# Altium project BMS.PrjPcb (part 2 of 2)

## Sheet Cells.SchDoc
size A4
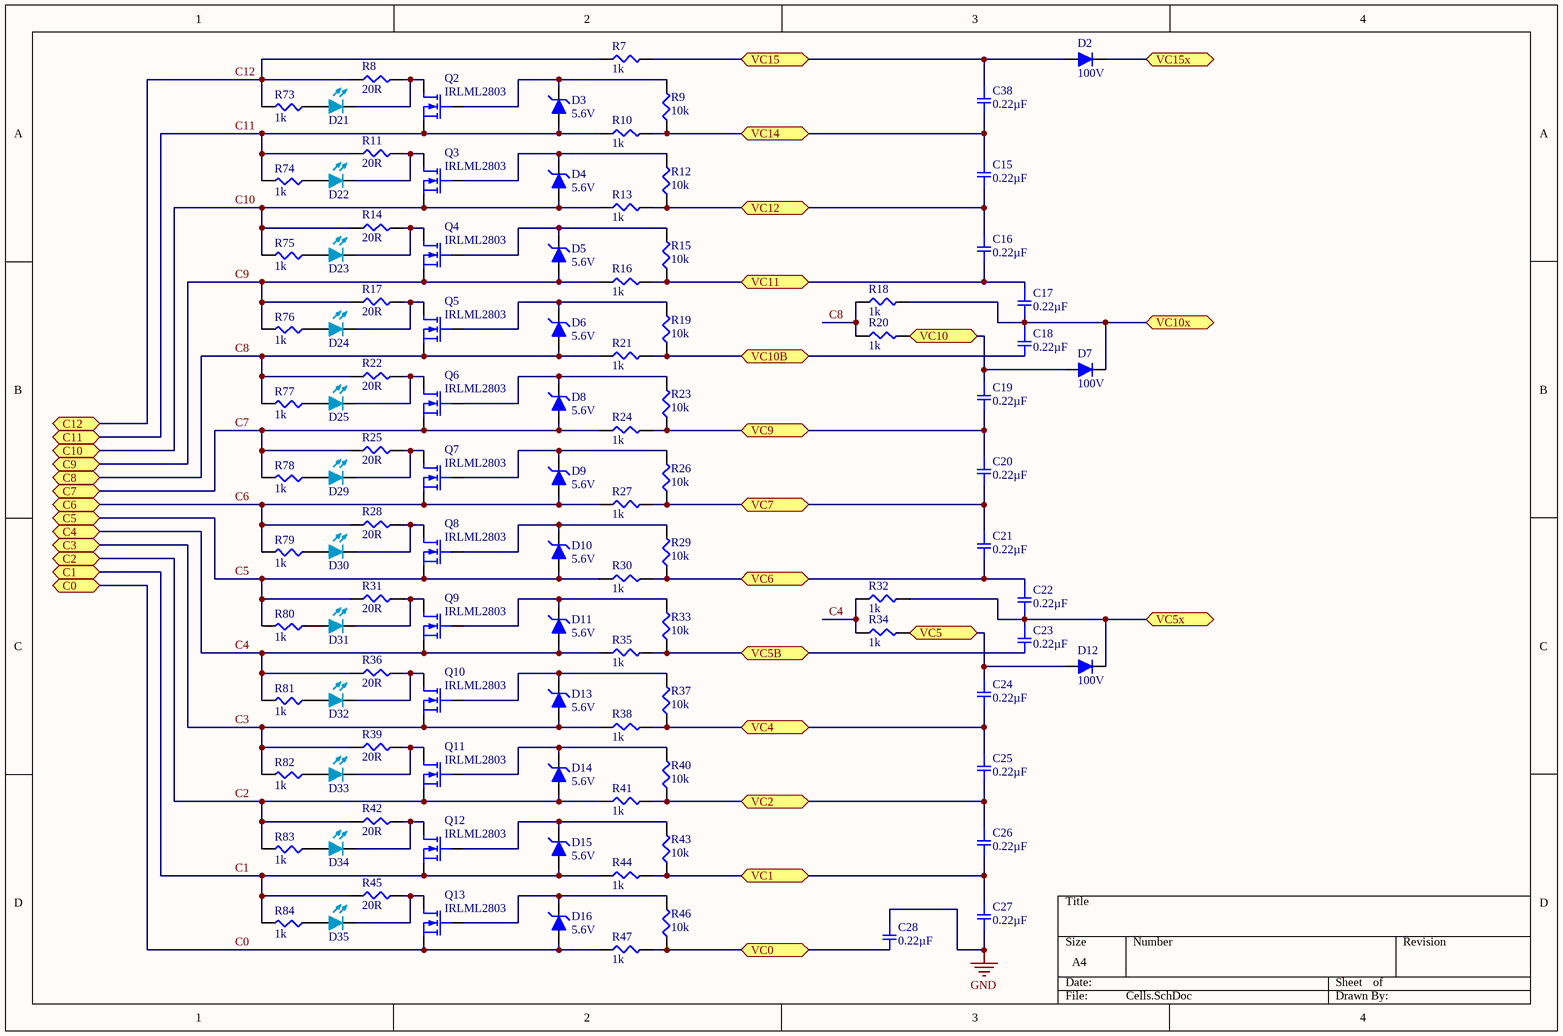
[diagram p6: Cells.SchDoc]

### Parts
C15  0.22µF  [SMD-0603C]
C16  0.22µF  [SMD-0603C]
C17  0.22µF  [SMD-0603C]
C18  0.22µF  [SMD-0603C]
C19  0.22µF  [SMD-0603C]
C20  0.22µF  [SMD-0603C]
C21  0.22µF  [SMD-0603C]
C22  0.22µF  [SMD-0603C]
C23  0.22µF  [SMD-0603C]
C24  0.22µF  [SMD-0603C]
C25  0.22µF  [SMD-0603C]
C26  0.22µF  [SMD-0603C]
C27  0.22µF  [SMD-0603C]
C28  0.22µF  [SMD-0603C]
C38  0.22µF  [SMD-0603C]
D2  100V  [SOD-323]
D3  5.6V  [SOD-323]
D4  5.6V  [SOD-323]
D5  5.6V  [SOD-323]
D6  5.6V  [SOD-323]
D7  100V  [SOD-323]
D8  5.6V  [SOD-323]
D9  5.6V  [SOD-323]
D10  5.6V  [SOD-323]
D11  5.6V  [SOD-323]
D12  100V  [SOD-323]
D13  5.6V  [SOD-323]
D14  5.6V  [SOD-323]
D15  5.6V  [SOD-323]
D16  5.6V  [SOD-323]
D21  LED  [LED0603]  (value not drawn)
D22  LED  [LED0603]  (value not drawn)
D23  LED  [LED0603]  (value not drawn)
D24  LED  [LED0603]  (value not drawn)
D25  LED  [LED0603]  (value not drawn)
D29  LED  [LED0603]  (value not drawn)
D30  LED  [LED0603]  (value not drawn)
D31  LED  [LED0603]  (value not drawn)
D32  LED  [LED0603]  (value not drawn)
D33  LED  [LED0603]  (value not drawn)
D34  LED  [LED0603]  (value not drawn)
D35  LED  [LED0603]  (value not drawn)
Q2  IRLML2803  [SOT23-3]
Q3  IRLML2803  [SOT23-3]
Q4  IRLML2803  [SOT23-3]
Q5  IRLML2803  [SOT23-3]
Q6  IRLML2803  [SOT23-3]
Q7  IRLML2803  [SOT23-3]
Q8  IRLML2803  [SOT23-3]
Q9  IRLML2803  [SOT23-3]
Q10  IRLML2803  [SOT23-3]
Q11  IRLML2803  [SOT23-3]
Q12  IRLML2803  [SOT23-3]
Q13  IRLML2803  [SOT23-3]
R7  1k  [SMD-0603-RES]
R8  20R  [SMD-1206-RES]
R9  10k  [SMD-0603-RES]
R10  1k  [SMD-0603-RES]
R11  20R  [SMD-1206-RES]
R12  10k  [SMD-0603-RES]
R13  1k  [SMD-0603-RES]
R14  20R  [SMD-1206-RES]
R15  10k  [SMD-0603-RES]
R16  1k  [SMD-0603-RES]
R17  20R  [SMD-1206-RES]
R18  1k  [SMD-0603-RES]
R19  10k  [SMD-0603-RES]
R20  1k  [SMD-0603-RES]
R21  1k  [SMD-0603-RES]
R22  20R  [SMD-1206-RES]
R23  10k  [SMD-0603-RES]
R24  1k  [SMD-0603-RES]
R25  20R  [SMD-1206-RES]
R26  10k  [SMD-0603-RES]
R27  1k  [SMD-0603-RES]
R28  20R  [SMD-1206-RES]
R29  10k  [SMD-0603-RES]
R30  1k  [SMD-0603-RES]
R31  20R  [SMD-1206-RES]
R32  1k  [SMD-0603-RES]
R33  10k  [SMD-0603-RES]
R34  1k  [SMD-0603-RES]
R35  1k  [SMD-0603-RES]
R36  20R  [SMD-1206-RES]
R37  10k  [SMD-0603-RES]
R38  1k  [SMD-0603-RES]
R39  20R  [SMD-1206-RES]
R40  10k  [SMD-0603-RES]
R41  1k  [SMD-0603-RES]
R42  20R  [SMD-1206-RES]
R43  10k  [SMD-0603-RES]
R44  1k  [SMD-0603-RES]
R45  20R  [SMD-1206-RES]
R46  10k  [SMD-0603-RES]
R47  1k  [SMD-0603-RES]
R73  1k  [SMD-0603-RES]
R74  1k  [SMD-0603-RES]
R75  1k  [SMD-0603-RES]
R76  1k  [SMD-0603-RES]
R77  1k  [SMD-0603-RES]
R78  1k  [SMD-0603-RES]
R79  1k  [SMD-0603-RES]
R80  1k  [SMD-0603-RES]
R81  1k  [SMD-0603-RES]
R82  1k  [SMD-0603-RES]
R83  1k  [SMD-0603-RES]
R84  1k  [SMD-0603-RES]

### Ports
C0, C1, C2, C3, C4, C5, C6, C7, C8, C9, C10, C11, C12, VC0, VC1, VC2, VC4, VC5, VC5B, VC5x, VC6, VC7, VC9, VC10, VC10B, VC10x, VC11, VC12, VC14, VC15, VC15x

### Nets
GND: C27.2 C28.1
C0: D16.2(A) Q13.2(S) R47.1 ; port C0
C1: D15.2(A) Q12.2(S) R44.1 R45.1 R84.2 ; port C1
C2: D14.2(A) Q11.2(S) R41.1 R42.1 R83.2 ; port C2
C3: D13.2(A) Q10.2(S) R38.1 R39.1 R82.2 ; port C3
C4: D11.2(A) Q9.2(S) R32.1 R34.1 R35.1 R36.1 R81.2 ; port C4
C5: D10.2(A) Q8.2(S) R30.1 R31.1 R80.2 ; port C5
C6: D9.2(A) Q7.2(S) R27.1 R28.1 R79.2 ; port C6
C7: D8.2(A) Q6.2(S) R24.1 R25.1 R78.2 ; port C7
C8: D6.2(A) Q5.2(S) R18.1 R20.1 R21.1 R22.1 R77.2 ; port C8
C9: D5.2(A) Q4.2(S) R16.1 R17.1 R76.2 ; port C9
C10: D4.2(A) Q3.2(S) R13.1 R14.1 R75.2 ; port C10
C11: D3.2(A) Q2.2(S) R10.1 R11.1 R74.2 ; port C11
C12: R7.1 R8.1 R73.2 ; port C12
VC0: C28.2 R46.1 R47.2 ; port VC0
VC1: C26.2 C27.1 R43.1 R44.2 ; port VC1
VC2: C25.2 C26.1 R40.1 R41.2 ; port VC2
VC4: C24.2 C25.1 R37.1 R38.2 ; port VC4
VC5: C24.1 D12.2(A) R34.2 ; port VC5
VC5B: C23.2 R33.1 R35.2 ; port VC5B
VC5x: C22.2 C23.1 D12.1(K) R32.2 ; port VC5x
VC6: C21.2 C22.1 R29.1 R30.2 ; port VC6
VC7: C20.2 C21.1 R26.1 R27.2 ; port VC7
VC9: C19.2 C20.1 R23.1 R24.2 ; port VC9
VC10: C19.1 D7.2(A) R20.2 ; port VC10
VC10B: C18.2 R19.1 R21.2 ; port VC10B
VC10x: C17.2 C18.1 D7.1(K) R18.2 ; port VC10x
VC11: C16.2 C17.1 R15.1 R16.2 ; port VC11
VC12: C15.2 C16.1 R12.1 R13.2 ; port VC12
VC14: C15.1 C38.2 R9.1 R10.2 ; port VC14
VC15: C38.1 D2.2(A) R7.2 ; port VC15
VC15x: D2.1(K) ; port VC15x
NetD3_1: D3.1(K) Q2.1(G) R9.2
NetD4_1: D4.1(K) Q3.1(G) R12.2
NetD5_1: D5.1(K) Q4.1(G) R15.2
NetD6_1: D6.1(K) Q5.1(G) R19.2
NetD8_1: D8.1(K) Q6.1(G) R23.2
NetD9_1: D9.1(K) Q7.1(G) R26.2
NetD10_1: D10.1(K) Q8.1(G) R29.2
NetD11_1: D11.1(K) Q9.1(G) R33.2
NetD13_1: D13.1(K) Q10.1(G) R37.2
NetD14_1: D14.1(K) Q11.1(G) R40.2
NetD15_1: D15.1(K) Q12.1(G) R43.2
NetD16_1: D16.1(K) Q13.1(G) R46.2
NetD21_A: D21.A R73.1
NetD21_C: D21.C Q2.3(D) R8.2
NetD22_A: D22.A R74.1
NetD22_C: D22.C Q3.3(D) R11.2
NetD23_A: D23.A R75.1
NetD23_C: D23.C Q4.3(D) R14.2
NetD24_A: D24.A R76.1
NetD24_C: D24.C Q5.3(D) R17.2
NetD25_A: D25.A R77.1
NetD25_C: D25.C Q6.3(D) R22.2
NetD29_A: D29.A R78.1
NetD29_C: D29.C Q7.3(D) R25.2
NetD30_A: D30.A R79.1
NetD30_C: D30.C Q8.3(D) R28.2
NetD31_A: D31.A R80.1
NetD31_C: D31.C Q9.3(D) R31.2
NetD32_A: D32.A R81.1
NetD32_C: D32.C Q10.3(D) R36.2
NetD33_A: D33.A R82.1
NetD33_C: D33.C Q11.3(D) R39.2
NetD34_A: D34.A R83.1
NetD34_C: D34.C Q12.3(D) R42.2
NetD35_A: D35.A R84.1
NetD35_C: D35.C Q13.3(D) R45.2

### Library data of the parts
C15-C28 C38 = GCJ188R71E224KA12D: CAP CER 0.22UF 25V X7R 0603; Manufacturer: Murata Electronics North America; Factory Stock: 0; Unit Price (USD): 0.24; Minimum Quantity: 1; Tolerance: ±10%; Datasheets: http://www.murata.com/~/media/webrenewal/support/library/catalog/products/capacitor/mlcc/c03e.ashx; Image: //media.digikey.com/Renders/Murata%20Renders/0603%28LQG18%29.jpg; Digi-Key Part Number: 490-5797-1-ND; Part Number: GCJ188R71E224KA12D; Quantity Available: 23903; @ qty: 0; Packaging: Cut Tape (CT); Series: GCJ; Part Status: Active; Value: 0.22µF; Voltage: 25V; Temperature Coefficient: X7R; Operating Temperature: -55°C ~ 125°C; Features: Soft Termination; Ratings: AEC-Q200; Applications: Automotive, Boardflex Sensitive; Mounting Type: Surface Mount, MLCC; Package / Case: 0603 (1608 Metric); Size / Dimension: 0.063" L x 0.031" W (1.60mm x 0.80mm); Height - Seated (Max): -; Thickness (Max): 0.035" (0.90mm); Lead Spacing: -; Lead Style: -
D2 D7 D12 = DIODE
D3-D6 D8-D11 D13-D16 = ZENER_5V6: Zener Diode 5.6V
D21-D25 D29-D35 = LED_BLUE: PartNumber: LTST-C193TGKT-5A; Manufacturer: Lite-On Inc.; PackageReference: 0603; PackageDescription: 0603 (1608 Metric); Mounting Technology: Surface Mount
Q2-Q13 = MOSFET-N: N-Channel MOSFET; Published: 8-Jun-2000; LatestRevisionDate: 17-Jul-2002; LatestRevisionNote: Re-released for DXP Platform.; PackageVersion: 1995/1996; PackageReference: E3; Publisher: Altium Limited; PackageDescription: TO, Flat Index; 3 In-Line, Axial Leads; Body Dia. 4.6mm; Lead Dia. 0.5 mm (max)
R7 R10 R13 R16 R18 R20 R21 R24 R27 R30 R32 R34 R35 R38 R41 R44 R47 R73-R84 = ERJ-3EKF1001V: RES SMD 1K OHM 1% 1/10W 0603; Manufacturer: Panasonic Electronic Components; Factory Stock: 0; Unit Price (USD): 0.00379; @ qty: 1500; Minimum Quantity: 1; Power (Watts): 0.1W, 1/10W; Temperature Coefficient: ±100ppm/°C; Part Number: ERJ-3EKF1001V; Datasheets: http://industrial.panasonic.com/www-cgi/jvcr13pz.cgi?E+PZ+3+AOA0002+ERJ3EKF1001V+7+WW; Image: //media.digikey.com/Photos/Panasonic%20Photos/MFG_ERJ-P6W%20Series.jpg; Digi-Key Part Number: P1.00KHCT-ND; Quantity Available: 5218845; Packaging: Cut Tape (CT); Series: ERJ; Part Status: Active; Value: 1k; Tolerance: ±1%; Composition: Thick Film; Features: Automotive AEC-Q200; Operating Temperature: -55°C ~ 155°C; Package / Case: 0603 (1608 Metric); Supplier Device Package: 0603; Size / Dimension: 0.063" L x 0.031" W (1.60mm x 0.80mm); Height - Seated (Max): 0.022" (0.55mm); Number of Terminations: 2; Failure Rate: -
R8 R11 R14 R17 R22 R25 R28 R31 R36 R39 R42 R45 = ERJ-8ENF20R0V: RES SMD 20 OHM 1% 1/4W 1206; Manufacturer: Panasonic Electronic Components; Factory Stock: 0; Unit Price (USD): 0.00933; @ qty: 1500; Minimum Quantity: 1; Value: 20; Power (Watts): 0.25W, 1/4W; Temperature Coefficient: ±100ppm/°C; Part Number: ERJ-8ENF20R0V; Datasheets: http://industrial.panasonic.com/www-cgi/jvcr13pz.cgi?E+PZ+3+AOA0002+ERJ8ENF20R0V+7+WW; Image: //media.digikey.com/Renders/Panasonic%20Renders/ERJ-1206%20Pkg.jpg; Digi-Key Part Number: P20.0FCT-ND; Quantity Available: 622513; Packaging: Cut Tape (CT); Series: ERJ; Part Status: Active; Tolerance: ±1%; Composition: Thick Film; Features: Automotive AEC-Q200; Operating Temperature: -55°C ~ 155°C; Package / Case: 1206 (3216 Metric); Supplier Device Package: 1206; Size / Dimension: 0.126" L x 0.063" W (3.20mm x 1.60mm); Height - Seated (Max): 0.028" (0.70mm); Number of Terminations: 2; Failure Rate: -
R9 R12 R15 R19 R23 R26 R29 R33 R37 R40 R43 R46 = ERJ-3EKF1002V: RES SMD 10K OHM 1% 1/10W 0603; Manufacturer: Panasonic Electronic Components; Factory Stock: 0; Unit Price (USD): 0.00379; @ qty: 1500; Minimum Quantity: 1; Power (Watts): 0.1W, 1/10W; Temperature Coefficient: ±100ppm/°C; Part Number: ERJ-3EKF1002V; Datasheets: http://industrial.panasonic.com/www-cgi/jvcr13pz.cgi?E+PZ+3+AOA0002+ERJ3EKF1002V+7+WW; Image: //media.digikey.com/Photos/Panasonic%20Photos/MFG_ERJ-P6W%20Series.jpg; Digi-Key Part Number: P10.0KHCT-ND; Quantity Available: 6703141; Packaging: Cut Tape (CT); Series: ERJ; Part Status: Active; Value: 10k; Tolerance: ±1%; Composition: Thick Film; Features: Automotive AEC-Q200; Operating Temperature: -55°C ~ 155°C; Package / Case: 0603 (1608 Metric); Supplier Device Package: 0603; Size / Dimension: 0.063" L x 0.031" W (1.60mm x 0.80mm); Height - Seated (Max): 0.022" (0.55mm); Number of Terminations: 2; Failure Rate: -

## Sheet ChargerDetection.SchDoc
size A4
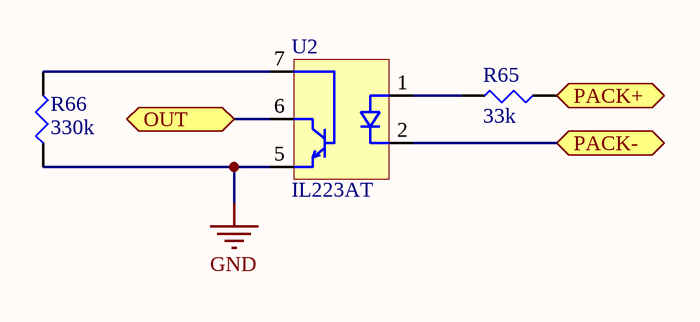
[diagram p7: ChargerDetection.SchDoc]

### Parts
R65  33k  [SMD-0603-RES]
R66  330k  [SMD-0603-RES]
U2  IL223AT  [SOIC-8]

### Ports
OUT, PACK+, PACK-

### Nets
GND: R66.1 U2.5(E)
PACK+: R65.1 ; port PACK+
PACK-: U2.2(K) ; port PACK-
CHG_DETECT: U2.6(C) ; port OUT
NetR65_2: R65.2 U2.1(A)
NetR66_2: R66.2 U2.7(B)

### Library data of the parts
R65 = ERJ-3EKF3302V: RES SMD 33K OHM 1% 1/10W 0603; Manufacturer: Panasonic Electronic Components; Factory Stock: 0; Unit Price (USD): 0.00379; @ qty: 1500; Minimum Quantity: 1; Power (Watts): 0.1W, 1/10W; Temperature Coefficient: ±100ppm/°C; Part Number: ERJ-3EKF3302V; Datasheets: http://industrial.panasonic.com/www-cgi/jvcr13pz.cgi?E+PZ+3+AOA0002+ERJ3EKF3302V+7+WW; Image: //media.digikey.com/Photos/Panasonic%20Photos/MFG_ERJ-P6W%20Series.jpg; Digi-Key Part Number: P33.0KHCT-ND; Quantity Available: 240194; Packaging: Cut Tape (CT); Series: ERJ; Part Status: Active; Value: 33k; Tolerance: ±1%; Composition: Thick Film; Features: Automotive AEC-Q200; Operating Temperature: -55°C ~ 155°C; Package / Case: 0603 (1608 Metric); Supplier Device Package: 0603; Size / Dimension: 0.063" L x 0.031" W (1.60mm x 0.80mm); Height - Seated (Max): 0.022" (0.55mm); Number of Terminations: 2; Failure Rate: -
R66 = ERJ-3EKF3303V: RES SMD 330K OHM 1% 1/10W 0603; Manufacturer: Panasonic Electronic Components; Factory Stock: 0; Unit Price (USD): 0.00379; @ qty: 1500; Minimum Quantity: 1; Power (Watts): 0.1W, 1/10W; Temperature Coefficient: ±100ppm/°C; Part Number: ERJ-3EKF3303V; Datasheets: http://industrial.panasonic.com/www-cgi/jvcr13pz.cgi?E+PZ+3+AOA0002+ERJ3EKF3303V+7+WW; Image: //media.digikey.com/Photos/Panasonic%20Photos/MFG_ERJ-P6W%20Series.jpg; Digi-Key Part Number: P330KHCT-ND; Quantity Available: 124170; Packaging: Cut Tape (CT); Series: ERJ; Part Status: Active; Value: 330k; Tolerance: ±1%; Composition: Thick Film; Features: Automotive AEC-Q200; Operating Temperature: -55°C ~ 155°C; Package / Case: 0603 (1608 Metric); Supplier Device Package: 0603; Size / Dimension: 0.063" L x 0.031" W (1.60mm x 0.80mm); Height - Seated (Max): 0.022" (0.55mm); Number of Terminations: 2; Failure Rate: -
U2 = IL223AT: Optocoupler

## Nets that join several sheets
3V3: BMS (11 pins), BQ76940 (C12.1 U1.8), U_Isolator (Q17_U_Isolator#1.2), U_Isolator (Q17_U_Isolator#2.2), U_Isolator (Q17_U_Isolator#3.2), EEPROM (C40.1 U4.8), NRF52 (C10.1 M1.11 R63.2 R64.2)
GND: BMS (5 pins), BQ76940 (10 pins), ProtectionAndShunt (C31.1 C33.2 NT1.1 Q14.1), U_Isolator (C42_U_Isolator#1.2 U3_U_Isolator#1.4), U_Isolator (C42_U_Isolator#2.2 U3_U_Isolator#2.4), U_Isolator (C42_U_Isolator#3.2 U3_U_Isolator#3.4), EEPROM (5 pins), NRF52 (8 pins), Cells (C27.2 C28.1), ChargerDetection (R66.1 U2.5)
PACK+: BMS (6 pins), ProtectionAndShunt (C29.2 D17.1 D18.1), ChargerDetection (R65.1)
PACK-: BMS (5 pins), ProtectionAndShunt (15 pins), ChargerDetection (U2.2)
ALERT: BQ76940 (C14.1 R5.2 U1.44), NRF52 (M1.21)
BAT-: BMS (BAT-.1), ProtectionAndShunt (D18.2 NT1.2 NT2.1 R52.1)
BTN_BOOT: BMS (BOOT.2), BQ76940 (R6.1)
BTN_PAIR: BMS (PAIR.1), NRF52 (M1.35)
BTN_STAT: BMS (STAT.1), NRF52 (M1.34)
C0: BMS (CELLS.1), Cells (D16.2 Q13.2 R47.1)
C1: BMS (BOOT.1 CELLS.2), Cells (5 pins)
C2: BMS (CELLS.3), Cells (5 pins)
C3: BMS (CELLS.4), Cells (5 pins)
C4: BMS (CELLS.5), Cells (7 pins)
C5: BMS (CELLS.6), Cells (5 pins)
C6: BMS (CELLS.7), Cells (5 pins)
C7: BMS (CELLS.8), Cells (5 pins)
C8: BMS (CELLS.9), Cells (7 pins)
C9: BMS (CELLS.10), Cells (5 pins)
C10: BMS (CELLS.11), Cells (5 pins)
C11: BMS (CELLS.12), Cells (5 pins)
C12: BMS (CELLS.13), BQ76940 (C1.1 D1.2 R1.2 R2.2), Cells (R7.1 R8.1 R73.2)
CHG: BQ76940 (U1.2), ProtectionAndShunt (Q14.2)
CHG_DETECT: NRF52 (M1.8), ChargerDetection (U2.6)
DSG: BQ76940 (U1.1), ProtectionAndShunt (L1.2 L7.2 R50.2)
EXT1.EN: U_Isolator (R67_U_Isolator#1.2), NRF52 (M1.7)
EXT1.IN: U_Isolator (U3_U_Isolator#1.2), NRF52 (M1.6)
EXT1.OUT: U_Isolator (U3_U_Isolator#1.3), NRF52 (M1.5)
EXT2.EN: U_Isolator (R67_U_Isolator#2.2), NRF52 (M1.4)
EXT2.IN: U_Isolator (U3_U_Isolator#2.2), NRF52 (M1.3)
EXT2.OUT: U_Isolator (U3_U_Isolator#2.3), NRF52 (M1.2)
EXT3.EN: U_Isolator (R67_U_Isolator#3.2), NRF52 (M1.15)
EXT3.IN: U_Isolator (U3_U_Isolator#3.2), NRF52 (M1.16)
EXT3.OUT: U_Isolator (U3_U_Isolator#3.3), NRF52 (M1.17)
EXT_GND: BMS (EXT1.2), U_Isolator (5 pins)
EXT_GND: BMS (EXT2.2), U_Isolator (5 pins)
EXT_GND: BMS (EXT3.2), U_Isolator (5 pins)
EXT_IN: BMS (EXT1.5), U_Isolator (D26_U_Isolator#1.1 U3_U_Isolator#1.7)
EXT_IN: BMS (EXT2.5), U_Isolator (D26_U_Isolator#2.1 U3_U_Isolator#2.7)
EXT_IN: BMS (EXT3.5), U_Isolator (D26_U_Isolator#3.1 U3_U_Isolator#3.7)
EXT_OUT: BMS (EXT1.4), U_Isolator (D27_U_Isolator#1.1 U3_U_Isolator#1.6)
EXT_OUT: BMS (EXT2.4), U_Isolator (D27_U_Isolator#2.1 U3_U_Isolator#2.6)
EXT_OUT: BMS (EXT3.4), U_Isolator (D27_U_Isolator#3.1 U3_U_Isolator#3.6)
EXT_VCC: BMS (EXT1.3), U_Isolator (L5_U_Isolator#1.1)
EXT_VCC: BMS (EXT2.3), U_Isolator (L5_U_Isolator#2.1)
EXT_VCC: BMS (EXT3.3), U_Isolator (L5_U_Isolator#3.1)
LED_BAL: BMS (BAL.C), NRF52 (R60.2)
LED_BAT1: BMS (BG1.C), NRF52 (R53.2)
LED_BAT2: BMS (BG2.C), NRF52 (R54.2)
LED_BAT3: BMS (BG3.C), NRF52 (R55.2)
LED_BAT4: BMS (BG4.C), NRF52 (R56.2)
LED_BAT5: BMS (BG5.C), NRF52 (R57.2)
LED_BT: BMS (BLT.C), NRF52 (R61.2)
LED_CHG: BMS (CHG.C), NRF52 (R58.2)
LED_DSG: BMS (DSG.C), NRF52 (R59.2)
LED_ERR: BMS (ERR.C), NRF52 (R62.2)
NetM1_22: BQ76940 (U1.4), EEPROM (U4.5), NRF52 (M1.22 R63.1)
NetM1_23: BQ76940 (U1.5), EEPROM (U4.6), NRF52 (M1.23 R64.1)
NTC1_A: BMS (NTC1.1), BQ76940 (C4.1 U1.18)
NTC2_A: BMS (NTC2.1), BQ76940 (C7.1 U1.13)
SOFT_DSG: ProtectionAndShunt (L6.2 R72.2), NRF52 (M1.32)
SRN: BQ76940 (U1.43), ProtectionAndShunt (C32.2 C33.1 R49.2)
SRP: BQ76940 (U1.42), ProtectionAndShunt (C31.2 C32.1 R48.2)
SWCLK: BMS (SWD.4), NRF52 (M1.36)
SWDIO: BMS (SWD.2), NRF52 (M1.37)
VC0: BQ76940 (U1.41), Cells (C28.2 R46.1 R47.2)
VC1: BQ76940 (U1.40), Cells (C26.2 C27.1 R43.1 R44.2)
VC2: BQ76940 (U1.39), Cells (C25.2 C26.1 R40.1 R41.2)
VC4: BQ76940 (U1.37 U1.38), Cells (C24.2 C25.1 R37.1 R38.2)
VC5: BQ76940 (U1.36), Cells (C24.1 D12.2 R34.2)
VC5B: BQ76940 (U1.35), Cells (C23.2 R33.1 R35.2)
VC5x: BMS (NTC2.2), BQ76940 (6 pins), Cells (C22.2 C23.1 D12.1 R32.2)
VC6: BQ76940 (U1.34), Cells (C21.2 C22.1 R29.1 R30.2)
VC7: BQ76940 (U1.33), Cells (C20.2 C21.1 R26.1 R27.2)
VC9: BQ76940 (U1.31 U1.32), Cells (C19.2 C20.1 R23.1 R24.2)
VC10: BQ76940 (U1.30), Cells (C19.1 D7.2 R20.2)
VC10B: BQ76940 (U1.29), Cells (C18.2 R19.1 R21.2)
VC10x: BMS (NTC1.2), BQ76940 (6 pins), Cells (C17.2 C18.1 D7.1 R18.2)
VC11: BQ76940 (U1.28), Cells (C16.2 C17.1 R15.1 R16.2)
VC12: BQ76940 (U1.27), Cells (C15.2 C16.1 R12.1 R13.2)
VC14: BQ76940 (U1.25 U1.26), Cells (C15.1 C38.2 R9.1 R10.2)
VC15: BQ76940 (U1.24), Cells (C38.1 D2.2 R7.2)
VC15x: BQ76940 (U1.20), Cells (D2.1)